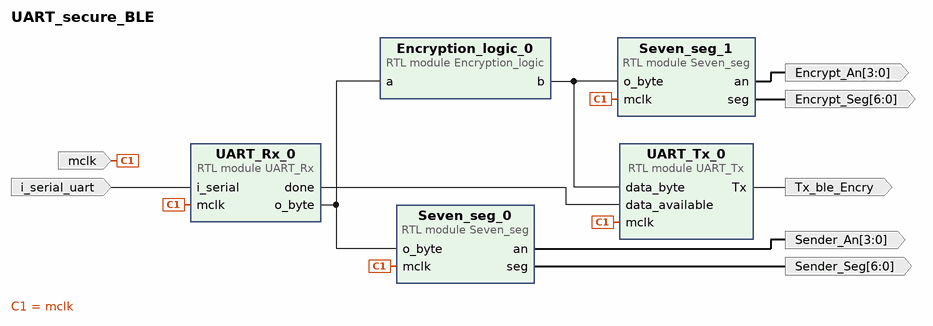
[diagram p0: block diagram of the top level]
# Vivado block design UART_secure_BLE, xc7s50csga324-1, Vivado 2017.4
create_bd_design UART_secure_BLE

create_bd_port -dir I mclk
create_bd_port -dir I i_serial_uart
create_bd_port -dir O -from 3 -to 0 Sender_An
create_bd_port -dir O -from 6 -to 0 Sender_Seg
create_bd_port -dir O -from 3 -to 0 Encrypt_An
create_bd_port -dir O -from 6 -to 0 Encrypt_Seg
create_bd_port -dir O Tx_ble_Encry

create_bd_cell -type module -reference UART_Rx UART_Rx_0
create_bd_cell -type module -reference Seven_seg Seven_seg_0
create_bd_cell -type module -reference Encryption_logic Encryption_logic_0
create_bd_cell -type module -reference UART_Tx UART_Tx_0
create_bd_cell -type module -reference Seven_seg Seven_seg_1

# ---- connections ----

connect_bd_net -net mclk_0_1 [get_bd_ports mclk] \
  [get_bd_pins UART_Rx_0/mclk] [get_bd_pins Seven_seg_0/mclk] [get_bd_pins Seven_seg_1/mclk] [get_bd_pins UART_Tx_0/mclk]
connect_bd_net -net i_serial_0_1 [get_bd_ports i_serial_uart] [get_bd_pins UART_Rx_0/i_serial]
connect_bd_net [get_bd_pins UART_Rx_0/o_byte] [get_bd_pins Seven_seg_0/o_byte] [get_bd_pins Encryption_logic_0/a]
connect_bd_net [get_bd_pins Seven_seg_0/an] [get_bd_ports Sender_An]
connect_bd_net [get_bd_pins Seven_seg_0/seg] [get_bd_ports Sender_Seg]
connect_bd_net [get_bd_pins Encryption_logic_0/b] [get_bd_pins Seven_seg_1/o_byte] [get_bd_pins UART_Tx_0/data_byte]
connect_bd_net [get_bd_pins Seven_seg_1/an] [get_bd_ports Encrypt_An]
connect_bd_net [get_bd_pins Seven_seg_1/seg] [get_bd_ports Encrypt_Seg]
connect_bd_net [get_bd_pins UART_Rx_0/done] [get_bd_pins UART_Tx_0/data_available]
connect_bd_net [get_bd_pins UART_Tx_0/Tx] [get_bd_ports Tx_ble_Encry]

validate_bd_design
save_bd_design
